# Altium schematic sheet APP_1_DDR3_e.SchDoc
size Tabloid; DocumentNumber: 5; SheetNumber: 5; SheetTotal: 13; Sheet_Name: DDR3; Size: 11x17
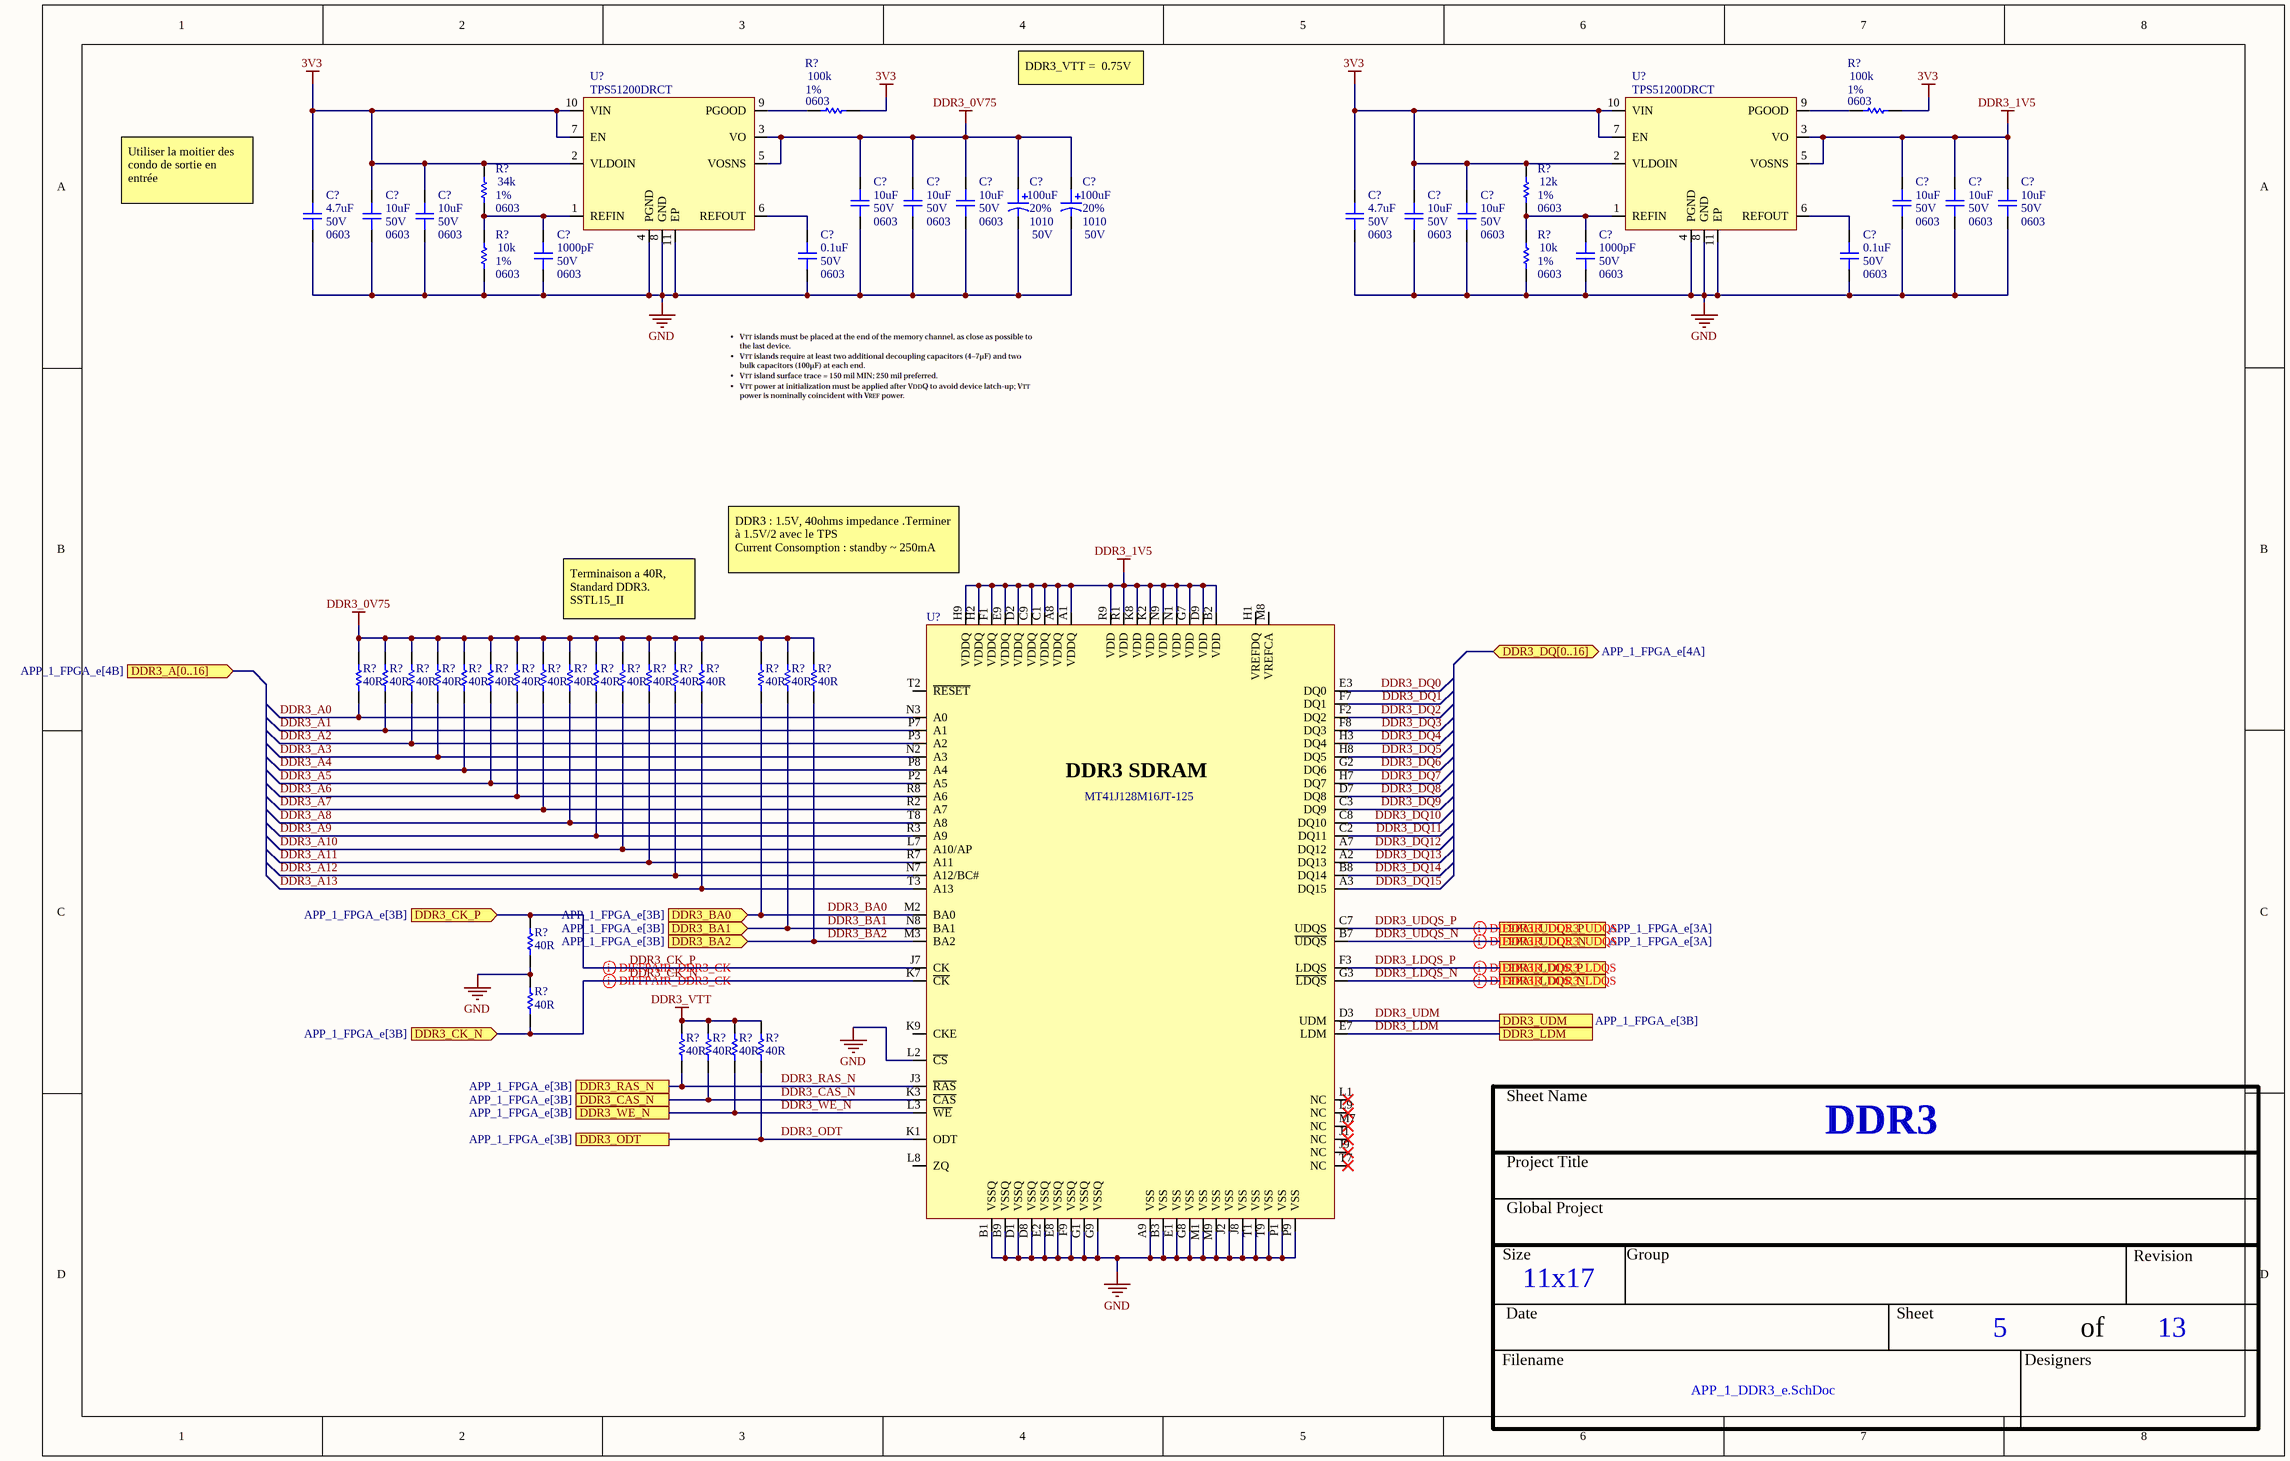
[diagram p0: APP_1_DDR3_e.SchDoc]

## Parts
(Parts that share a designator on the sheet are numbered #1, #2 ... from top to bottom, then left to right.)
C?#1  value 10uF  Voltage: 50V  Package: 0603  [CAP_0603]  (hidden comment: CAP - 0603)
C?#2  value 10uF  Voltage: 50V  Package: 0603  [CAP_0603]  (hidden comment: CAP - 0603)
C?#3  value 10uF  Voltage: 50V  Package: 0603  [CAP_0603]  (hidden comment: CAP - 0603)
C?#4  value 100uF  Voltage: 50V  Package: 1010  Precision: 20%  [CAP_ALU_1010_vishay]  (hidden comment: MAL215099101E3)
C?#5  value 100uF  Voltage: 50V  Package: 1010  Precision: 20%  [CAP_ALU_1010_vishay]  (hidden comment: MAL215099101E3)
C?#6  value 10uF  Voltage: 50V  Package: 0603  [CAP_0603]  (hidden comment: CAP - 0603)
C?#7  value 10uF  Voltage: 50V  Package: 0603  [CAP_0603]  (hidden comment: CAP - 0603)
C?#8  value 10uF  Voltage: 50V  Package: 0603  [CAP_0603]  (hidden comment: CAP - 0603)
C?#9  value 4.7uF  Voltage: 50V  Package: 0603  [CAP_0603]  (hidden comment: CAP - 0603)
C?#10  value 10uF  Voltage: 50V  Package: 0603  [CAP_0603]  (hidden comment: CAP - 0603)
C?#11  value 10uF  Voltage: 50V  Package: 0603  [CAP_0603]  (hidden comment: CAP - 0603)
C?#12  value 4.7uF  Voltage: 50V  Package: 0603  [CAP_0603]  (hidden comment: CAP - 0603)
C?#13  value 10uF  Voltage: 50V  Package: 0603  [CAP_0603]  (hidden comment: CAP - 0603)
C?#14  value 10uF  Voltage: 50V  Package: 0603  [CAP_0603]  (hidden comment: CAP - 0603)
C?#15  value 1000pF  Voltage: 50V  Package: 0603  [CAP_0603]  (hidden comment: CAP - 0603)
C?#16  value 0.1uF  Voltage: 50V  Package: 0603  [CAP_0603]  (hidden comment: CAP - 0603)
C?#17  value 1000pF  Voltage: 50V  Package: 0603  [CAP_0603]  (hidden comment: CAP - 0603)
C?#18  value 0.1uF  Voltage: 50V  Package: 0603  [CAP_0603]  (hidden comment: CAP - 0603)
R?#1  value 100k  Package: 0603  Precision: 1%  [RES_0603]  (hidden comment: RES - 0603)
R?#2  value 100k  Package: 0603  Precision: 1%  [RES_0603]  (hidden comment: RES - 0603)
R?#3  value 34k  Package: 0603  Precision: 1%  [RES_0603]  (hidden comment: RES - 0603)
R?#4  value 12k  Package: 0603  Precision: 1%  [RES_0603]  (hidden comment: RES - 0603)
R?#5  value 10k  Package: 0603  Precision: 1%  [RES_0603]  (hidden comment: RES - 0603)
R?#6  value 10k  Package: 0603  Precision: 1%  [RES_0603]  (hidden comment: RES - 0603)
R?#7  value 40R  (hidden comment: Resistor)
R?#8  value 40R  (hidden comment: Resistor)
R?#9  value 40R  (hidden comment: Resistor)
R?#10  value 40R  (hidden comment: Resistor)
R?#11  value 40R  (hidden comment: Resistor)
R?#12  value 40R  (hidden comment: Resistor)
R?#13  value 40R  (hidden comment: Resistor)
R?#14  value 40R  (hidden comment: Resistor)
R?#15  value 40R  (hidden comment: Resistor)
R?#16  value 40R  (hidden comment: Resistor)
R?#17  value 40R  (hidden comment: Resistor)
R?#18  value 40R  (hidden comment: Resistor)
R?#19  value 40R  (hidden comment: Resistor)
R?#20  value 40R  (hidden comment: Resistor)
R?#21  value 40R  (hidden comment: Resistor)
R?#22  value 40R  (hidden comment: Resistor)
R?#23  value 40R  (hidden comment: Resistor)
R?#24  value 40R  (hidden comment: Resistor)
R?#25  value 40R  (hidden comment: Resistor)
R?#26  value 40R  (hidden comment: Resistor)
R?#27  value 40R  (hidden comment: Resistor)
R?#28  value 40R  (hidden comment: Resistor)
R?#29  value 40R  (hidden comment: Resistor)
U?#1  TPS51200DRCT  [REG_PMIC_TPS51200DRCT]
U?#2  TPS51200DRCT  [REG_PMIC_TPS51200DRCT]
U?#3  MT41J128M16JT-125  [MEM_DDR3_MT41J128M16JT-125]

## Ports
DDR3_A[0..16] (in, see APP_1_FPGA_e[4B]), DDR3_BA0 (in, see APP_1_FPGA_e[3B]), DDR3_BA1 (in, see APP_1_FPGA_e[3B]), DDR3_BA2 (in, see APP_1_FPGA_e[3B]), DDR3_CAS_N (see APP_1_FPGA_e[3B]), DDR3_CK_N (in, see APP_1_FPGA_e[3B]), DDR3_CK_P (in, see APP_1_FPGA_e[3B]), DDR3_DQ[0..16] (bidir, see APP_1_FPGA_e[4A]), DDR3_LDM, DDR3_LDQS_N, DDR3_LDQS_P, DDR3_ODT (see APP_1_FPGA_e[3B]), DDR3_RAS_N (see APP_1_FPGA_e[3B]), DDR3_UDM (see APP_1_FPGA_e[3B]), DDR3_UDQS_N (see APP_1_FPGA_e[3A]), DDR3_UDQS_P (see APP_1_FPGA_e[3A]), DDR3_WE_N (see APP_1_FPGA_e[3B])

## Nets
3V3: C?#9.2 C?#10.2 C?#11.2 C?#12.2 C?#13.2 C?#14.2 R?#1.2 R?#2.2 R?#3.2 R?#4.2 U?#1.2(VLDOIN) U?#1.7(EN) U?#1.10(VIN) U?#2.2(VLDOIN) U?#2.7(EN) U?#2.10(VIN)
DDR3_0V75: C?#1.2 C?#2.2 C?#3.2 C?#4.1 C?#5.1 R?#7.2 R?#8.2 R?#9.2 R?#10.2 R?#11.2 R?#12.2 R?#13.2 R?#14.2 R?#15.2 R?#16.2 R?#17.2 R?#18.2 R?#19.2 R?#20.2 R?#21.2 R?#22.2 R?#23.2 U?#1.3(VO) U?#1.5(VOSNS)
DDR3_1V5: C?#6.2 C?#7.2 C?#8.2 U?#2.3(VO) U?#2.5(VOSNS) U?#3.A1(VDDQ) U?#3.A8(VDDQ) U?#3.B2(VDD) U?#3.C1(VDDQ) U?#3.C9(VDDQ) U?#3.D2(VDDQ) U?#3.D9(VDD) U?#3.E9(VDDQ) U?#3.F1(VDDQ) U?#3.G7(VDD) U?#3.H2(VDDQ) U?#3.H9(VDDQ) U?#3.K2(VDD) U?#3.K8(VDD) U?#3.N1(VDD) U?#3.N9(VDD) U?#3.R1(VDD) U?#3.R9(VDD)
DDR3_VTT: R?#26.2 R?#27.2 R?#28.2 R?#29.2
GND: C?#1.1 C?#2.1 C?#3.1 C?#4.2 C?#5.2 C?#6.1 C?#7.1 C?#8.1 C?#9.1 C?#10.1 C?#11.1 C?#12.1 C?#13.1 C?#14.1 C?#15.1 C?#16.1 C?#17.1 C?#18.1 R?#5.1 R?#6.1 R?#24.1 R?#25.2 U?#1.4(PGND) U?#1.8(GND) U?#1.11(EP) U?#2.4(PGND) U?#2.8(GND) U?#2.11(EP) U?#3.A9(VSS) U?#3.B1(VSSQ) U?#3.B3(VSS) U?#3.B9(VSSQ) U?#3.D1(VSSQ) U?#3.D8(VSSQ) U?#3.E1(VSS) U?#3.E2(VSSQ) U?#3.E8(VSSQ) U?#3.F9(VSSQ) U?#3.G1(VSSQ) U?#3.G8(VSS) U?#3.G9(VSSQ) U?#3.J2(VSS) U?#3.J8(VSS) U?#3.L2(~{CS}) U?#3.M1(VSS) U?#3.M9(VSS) U?#3.P1(VSS) U?#3.P9(VSS) U?#3.T1(VSS) U?#3.T9(VSS)
DDR3_A0: R?#7.1 U?#3.N3(A0)
DDR3_A1: R?#8.1 U?#3.P7(A1)
DDR3_A2: R?#9.1 U?#3.P3(A2)
DDR3_A3: R?#10.1 U?#3.N2(A3)
DDR3_A4: R?#11.1 U?#3.P8(A4)
DDR3_A5: R?#12.1 U?#3.P2(A5)
DDR3_A6: R?#13.1 U?#3.R8(A6)
DDR3_A7: R?#14.1 U?#3.R2(A7)
DDR3_A8: R?#15.1 U?#3.T8(A8)
DDR3_A9: R?#16.1 U?#3.R3(A9)
DDR3_A10: R?#17.1 U?#3.L7(A10/AP)
DDR3_A11: R?#18.1 U?#3.R7(A11)
DDR3_A12: R?#19.1 U?#3.N7(A12/BC#)
DDR3_A13: R?#20.1 U?#3.T3(A13)
DDR3_BA0: R?#21.1 U?#3.M2(BA0) ; port DDR3_BA0
DDR3_BA1: R?#22.1 U?#3.N8(BA1) ; port DDR3_BA1
DDR3_BA2: R?#23.1 U?#3.M3(BA2) ; port DDR3_BA2
DDR3_CAS_N: R?#27.1 U?#3.K3(~{CAS}) ; port DDR3_CAS_N
DDR3_CK_N: R?#25.1 U?#3.K7(~{CK}) ; port DDR3_CK_N
DDR3_CK_P: R?#24.2 U?#3.J7(CK) ; port DDR3_CK_P
DDR3_DQ0: U?#3.E3(DQ0)
DDR3_DQ1: U?#3.F7(DQ1)
DDR3_DQ2: U?#3.F2(DQ2)
DDR3_DQ3: U?#3.F8(DQ3)
DDR3_DQ4: U?#3.H3(DQ4)
DDR3_DQ5: U?#3.H8(DQ5)
DDR3_DQ6: U?#3.G2(DQ6)
DDR3_DQ7: U?#3.H7(DQ7)
DDR3_DQ8: U?#3.D7(DQ8)
DDR3_DQ9: U?#3.C3(DQ9)
DDR3_DQ10: U?#3.C8(DQ10)
DDR3_DQ11: U?#3.C2(DQ11)
DDR3_DQ12: U?#3.A7(DQ12)
DDR3_DQ13: U?#3.A2(DQ13)
DDR3_DQ14: U?#3.B8(DQ14)
DDR3_DQ15: U?#3.A3(DQ15)
DDR3_LDM: U?#3.E7(LDM) ; port DDR3_LDM
DDR3_LDQS_N: U?#3.G3(~{LDQS}) ; port DDR3_LDQS_N
DDR3_LDQS_P: U?#3.F3(LDQS) ; port DDR3_LDQS_P
DDR3_ODT: R?#29.1 U?#3.K1(ODT) ; port DDR3_ODT
DDR3_RAS_N: R?#26.1 U?#3.J3(~{RAS}) ; port DDR3_RAS_N
DDR3_UDM: U?#3.D3(UDM) ; port DDR3_UDM
DDR3_UDQS_N: U?#3.B7(~{UDQS}) ; port DDR3_UDQS_N
DDR3_UDQS_P: U?#3.C7(UDQS) ; port DDR3_UDQS_P
DDR3_WE_N: R?#28.1 U?#3.L3(~{WE}) ; port DDR3_WE_N
NetC?#15_2: C?#15.2 R?#3.1 R?#5.2 U?#1.1(REFIN)
NetC?#16_2: C?#16.2 U?#1.6(REFOUT)
NetC?#17_2: C?#17.2 R?#4.1 R?#6.2 U?#2.1(REFIN)
NetC?#18_2: C?#18.2 U?#2.6(REFOUT)
NetR?#1_1: R?#1.1 U?#1.9(PGOOD)
NetR?#2_1: R?#2.1 U?#2.9(PGOOD)

Not connected (* = marked no-connect by the designer): U?#3 H1(VREFDQ) J1(NC)* J9(NC)* K9(CKE) L1(NC)* L8(ZQ) L9(NC)* M7(NC)* M8(VREFCA) T2(~{RESET}) T7(NC)*

## Layout directives
differential pair: DDR3_CK_N, DDR3_CK_P, DDR3_LDQS_N, DDR3_LDQS_P, DDR3_UDQS_N, DDR3_UDQS_P

## Notes on the sheet
- DDR3_VTT =  0.75V
- Utiliser la moitier des condo de sortie en entrée
- (near R?#15) Terminaison a 40R, Standard DDR3. SSTL15_II
- DDR3 : 1.5V, 40ohms impedance .Terminer à 1.5V/2 avec le TPS
  Current Consomption : standby ~ 250mA
- Sheet Name
- Project Title
- Global Project
- Size
- Group
- Revision
- Date
- Sheet
- of
- Filename
- Designers
- (in symbol MEM_DDR3_MT41J128M16JT-125:K TR) DDR3 SDRAM

## Library data of the parts
C?#1-C?#3 C?#6-C?#18 = CAP - 0603: Precision: 10%; Current: *; CreatedBy: Jonathan Bouchard; Power: *
C?#4 C?#5 = CAP_ALU_MAL215099101E3: CAP - ALU 100uF 20% 50V - 1010; Current: 490mA; Mfg: Vishay Dale; Mfg Part Number: MAL215099101E3; HelpURL: http://www.vishay.com/docs/28395/150crz.pdf; CreatedBy: Jonathan Bouchard; Temperature: -55°C to 125°C; Power: *; Supplier 1: Digikey; Supplier Part Number 1: 4399PHDKR-ND
R?#7-R?#29 = Resistor: TC1: 0; SimulationGenericComponent: True; TC2: 0
U?#1 U?#2 = REG_PMIC_TPS51200DRCT: REG - DDR TERMINATION/REF REG - 10-VFDFN; Manufacturer #1: Texas Instruments; Value: DDR, DDR2, DDR3(L), DDR4; Voltage Rating: 2.375V ~ 3.5V; Current Rating: Source: 3A~4.5A, Sink: 3.5A~5.5A; GRAMS Lib Spec: 2.8; Magnetic Material: Unknown; Polarized: Yes; Tolerance: *; Power Max: *; HelpURL: http://www.ti.com/lit/ds/symlink/tps51200.pdf; CreatedBy/Date: Joel Lemay 2019-03-19; VerifiedBy: Nicolas V. (2019-05-31); Temperature: -40°C ~ 85°C; Package: 10-VFDFN; Manufacturer #2: *; Note: *; Assembly Type: SMD; Part Number #2: *; Part Number #1: TPS51200DRCT; Supplier 1: Digi-Key; Supplier Part Number 1: 296-23830-1-ND; Cryo: UNKNOWN
U?#3 = MEM_DDR3_MT41J128M16JT-125:K TR: MEM - DDR3 SDRAM 2GBIT 800MHZ - TFBGA-96; Voltage: 1.425 V ~ 1.575 V; Mfg: Micrel; Current: *; Power: *; Mfg Part Number: MT41J128M16JT-125; HelpURL: http://www.micron.com/~/media/Documents/Products/Data%20Sheet/DRAM/DDR3/2Gb_DDR3_SDRAM.pdf; CreatedBy: Jonathan Bouchard; Temperature: 0°C ~ 95°C (TC); Value: *; Precision: *; Package: TFBGA-96; Supplier 1: Digikey; Supplier Part Number 1: 557-1611-1-ND
R?#1-R?#6 = RES - 0603: Current: *; CreatedBy: Jonathan Bouchard